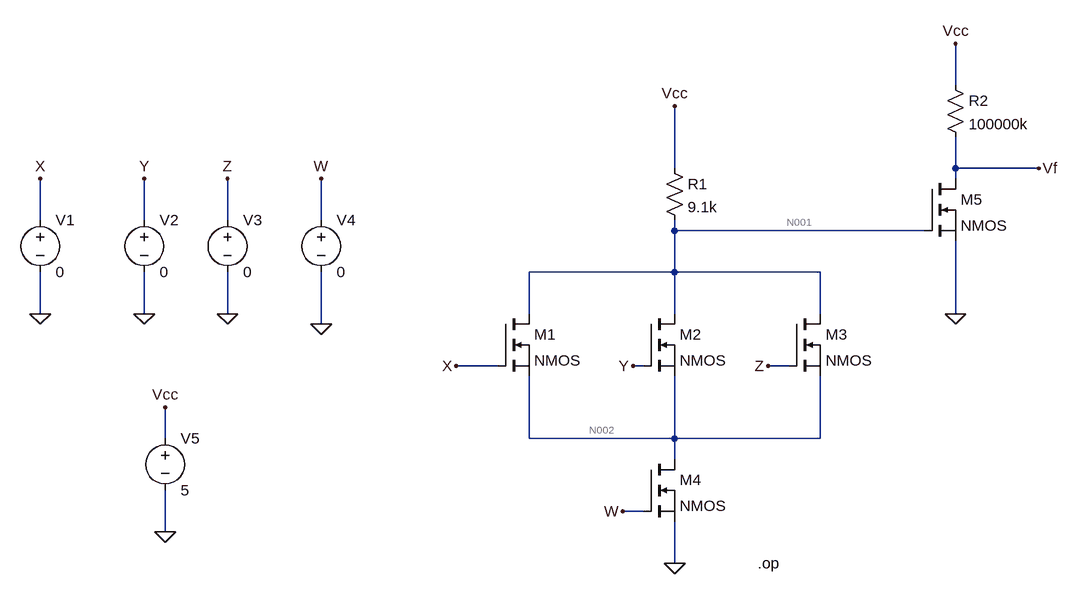
[diagram p0: schematic Draft7.asc]
Draft7.asc, the LTspice schematic file:
Version 4
SHEET 1 880 680
WIRE 704 -208 704 -272
WIRE 272 -80 272 -176
WIRE 704 -80 704 -128
WIRE 832 -80 704 -80
WIRE 704 -64 704 -80
WIRE -704 0 -704 -64
WIRE -544 0 -544 -64
WIRE -416 0 -416 -64
WIRE -272 0 -272 -64
WIRE 272 16 272 0
WIRE 656 16 272 16
WIRE 272 80 272 16
WIRE 272 80 48 80
WIRE 496 80 272 80
WIRE -704 144 -704 80
WIRE -544 144 -544 80
WIRE -416 144 -416 80
WIRE 48 144 48 80
WIRE 272 144 272 80
WIRE 496 144 496 80
WIRE 704 144 704 32
WIRE -272 160 -272 80
WIRE 0 224 -64 224
WIRE 224 224 208 224
WIRE 448 224 416 224
WIRE -512 336 -512 288
WIRE 48 336 48 240
WIRE 272 336 272 240
WIRE 272 336 48 336
WIRE 496 336 496 240
WIRE 496 336 272 336
WIRE 272 368 272 336
WIRE 224 448 192 448
WIRE -512 480 -512 416
WIRE 272 528 272 464
FLAG 272 -176 Vcc
FLAG -64 224 X
FLAG 208 224 Y
FLAG 416 224 Z
FLAG 192 448 W
FLAG 704 144 0
FLAG 832 -80 Vf
FLAG 272 528 0
FLAG -512 288 Vcc
FLAG -704 -64 X
FLAG -544 -64 Y
FLAG -416 -64 Z
FLAG -272 -64 W
FLAG -704 144 0
FLAG -544 144 0
FLAG -416 144 0
FLAG -272 160 0
FLAG -512 480 0
FLAG 704 -272 Vcc
SYMBOL nmos 0 144 R0
SYMATTR InstName M1
SYMBOL nmos 224 144 R0
SYMATTR InstName M2
SYMBOL nmos 448 144 R0
SYMATTR InstName M3
SYMBOL nmos 224 368 R0
SYMATTR InstName M4
SYMBOL res 256 -96 R0
SYMATTR InstName R1
SYMATTR Value 9.1k
SYMBOL nmos 656 -64 R0
SYMATTR InstName M5
SYMBOL res 688 -224 R0
SYMATTR InstName R2
SYMATTR Value 100000k
SYMBOL voltage -704 -16 R0
SYMATTR InstName V1
SYMATTR Value 0
SYMBOL voltage -544 -16 R0
SYMATTR InstName V2
SYMATTR Value 0
SYMBOL voltage -416 -16 R0
SYMATTR InstName V3
SYMATTR Value 0
SYMBOL voltage -272 -16 R0
SYMATTR InstName V4
SYMATTR Value 0
SYMBOL voltage -512 320 R0
SYMATTR InstName V5
SYMATTR Value 5
TEXT 400 528 Left 2 !.op

The netlist it stands for:
* Draft7.asc
M1 N001 X N002 N002 NMOS
M2 N001 Y N002 N002 NMOS
M3 N001 Z N002 N002 NMOS
M4 N002 W 0 0 NMOS
R1 Vcc N001 9.1k
M5 Vf N001 0 0 NMOS
R2 Vcc Vf 100000k
V1 X 0 0
V2 Y 0 0
V3 Z 0 0
V4 W 0 0
V5 Vcc 0 5
.model NMOS NMOS
.model PMOS PMOS
.lib standard.mos
.op
.backanno
.end

* Results of the author's LTspice run, read from the files saved beside the schematic
* Operating Point:
*   V(n001) = 5 V
*   V(x) = 0 V
*   V(n002) = 3.753 V
*   V(y) = 0 V
*   V(z) = 0 V
*   V(w) = 0 V
*   V(vcc) = 5 V
*   V(vf) = 500 µV
*   Id(M5) = 50 nA
*   Ig(M5) = 0 A
*   Ib(M5) = 0 A
*   Is(M5) = -49.99 nA
*   Id(M4) = 7.515 pA
*   Ig(M4) = 0 A
*   Ib(M4) = -3.762 pA
*   Is(M4) = -3.753 pA
*   Id(M3) = 2.505 pA
*   Ig(M3) = 0 A
*   Ib(M3) = -1.257 pA
*   Is(M3) = -1.247 pA
*   Id(M2) = 2.505 pA
*   Ig(M2) = 0 A
*   Ib(M2) = -1.257 pA
*   Is(M2) = -1.247 pA
*   Id(M1) = 2.505 pA
*   Ig(M1) = 0 A
*   Ib(M1) = -1.257 pA
*   Is(M1) = -1.247 pA
*   I(R2) = 50 nA
*   I(R1) = 7.515 pA
*   I(V5) = -50 nA
*   I(V4) = 0 A
*   I(V3) = 0 A
*   I(V2) = 0 A
*   I(V1) = 0 A
* From the log:
*   Semiconductor Device Operating Points:
*                           --- MOSFET Transistors ---
*   Name:          m5          m4          m3          m2          m1
*   Model:        nmos        nmos        nmos        nmos        nmos
*   Id:          5.00e-08    7.51e-12    2.50e-12    2.50e-12    2.50e-12
*   Vgs:         5.00e+00    0.00e+00   -3.75e+00   -3.75e+00   -3.75e+00
*   Vds:         5.00e-04    3.75e+00    1.25e+00    1.25e+00    1.25e+00
*   Vbs:         0.00e+00    0.00e+00    0.00e+00    0.00e+00    0.00e+00
*   Vth:         0.00e+00    0.00e+00    0.00e+00    0.00e+00    0.00e+00
*   Vdsat:       5.00e+00    0.00e+00    0.00e+00    0.00e+00    0.00e+00
*   Gm:          1.00e-08    0.00e+00    0.00e+00    0.00e+00    0.00e+00
*   Gds:         1.00e-04    0.00e+00    0.00e+00    0.00e+00    0.00e+00
*   Gmb:         0.00e+00    0.00e+00    0.00e+00    0.00e+00    0.00e+00
*   Cbd:         0.00e+00    0.00e+00    0.00e+00    0.00e+00    0.00e+00
*   Cbs:         0.00e+00    0.00e+00    0.00e+00    0.00e+00    0.00e+00
*   Cgsov:       0.00e+00    0.00e+00    0.00e+00    0.00e+00    0.00e+00
*   Cgdov:       0.00e+00    0.00e+00    0.00e+00    0.00e+00    0.00e+00
*   Cgbov:       0.00e+00    0.00e+00    0.00e+00    0.00e+00    0.00e+00
*   Cgs:         0.00e+00    0.00e+00    0.00e+00    0.00e+00    0.00e+00
*   Cgd:         0.00e+00    0.00e+00    0.00e+00    0.00e+00    0.00e+00
*   Cgb:         0.00e+00   -0.00e+00    0.00e+00    0.00e+00    0.00e+00